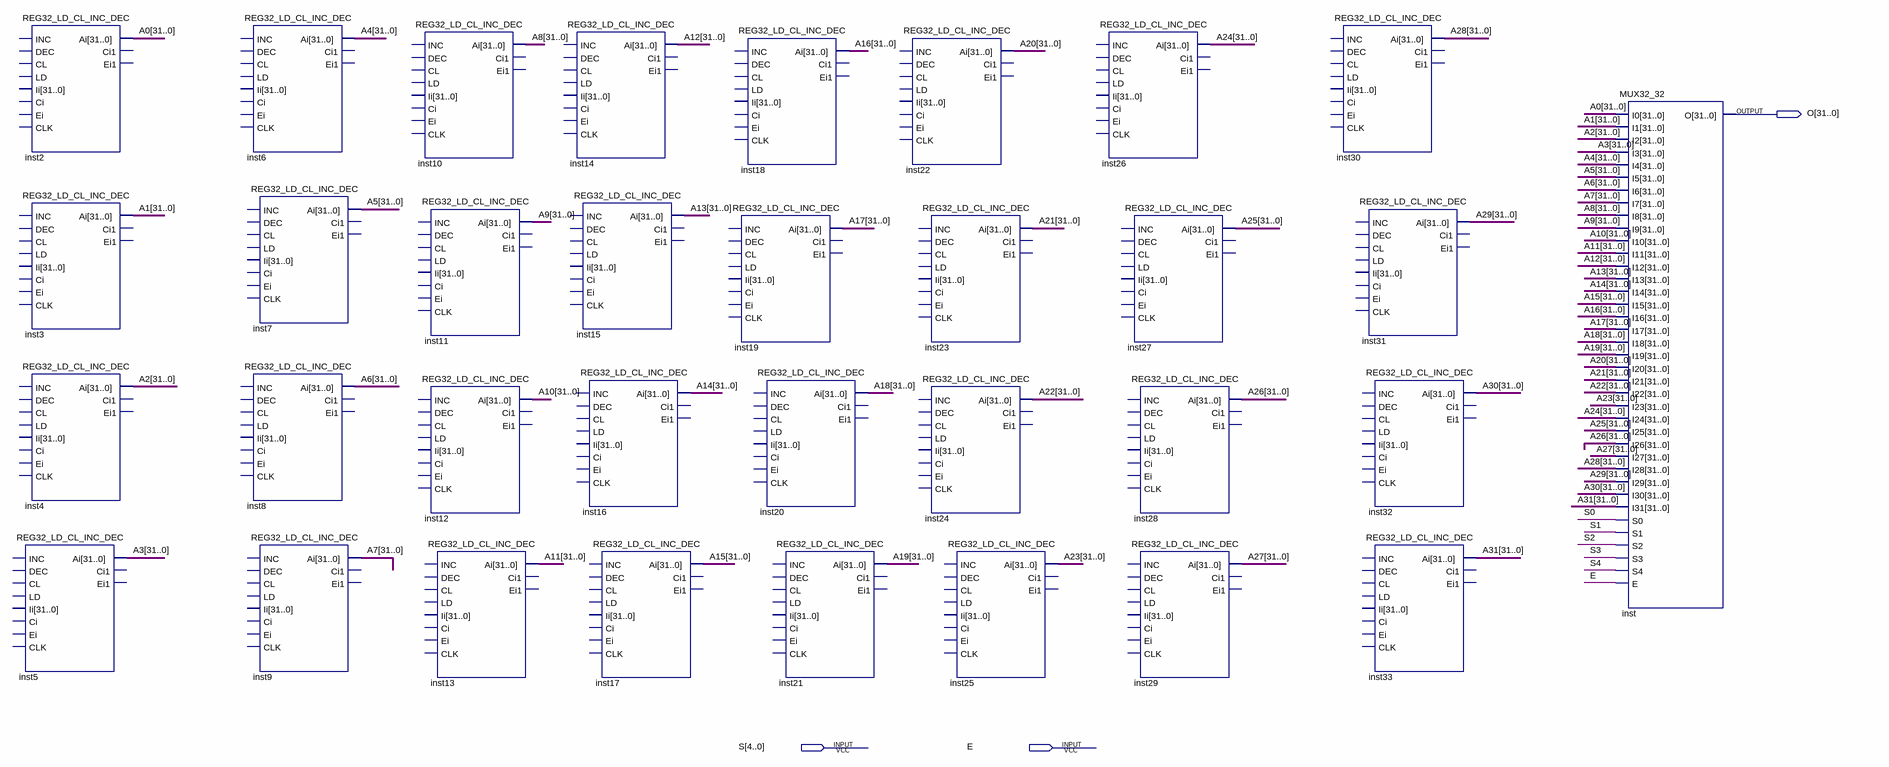
[diagram p0: schematic sheet]
// Quartus schematic 32xREG32_FILE.bdf as structural Verilog: 33 symbols, 3 pins
module \32xREG32_FILE  (
  input  [4:0] S,
  input  E,
  output [31:0] O
);

  wire [31:0] A0, A1, A2, A3, A4, A5, A6, A7, A8, A9, A10, A11, A12, A13, A14, A15, A16, A17, A18, A19, A20,
       A21, A22, A23, A24, A25, A26, A27, A28, A29, A30, A31;

  REG32_LD_CL_INC_DEC inst2 (.Ai(A0));  // open: INC, DEC, CL, LD, Ii, Ci, Ei, CLK, Ci1, Ei1
  REG32_LD_CL_INC_DEC inst3 (.Ai(A1));  // open: INC, DEC, CL, LD, Ii, Ci, Ei, CLK, Ci1, Ei1
  REG32_LD_CL_INC_DEC inst4 (.Ai(A2));  // open: INC, DEC, CL, LD, Ii, Ci, Ei, CLK, Ci1, Ei1
  REG32_LD_CL_INC_DEC inst5 (.Ai(A3));  // open: INC, DEC, CL, LD, Ii, Ci, Ei, CLK, Ci1, Ei1
  REG32_LD_CL_INC_DEC inst6 (.Ai(A4));  // open: INC, DEC, CL, LD, Ii, Ci, Ei, CLK, Ci1, Ei1
  REG32_LD_CL_INC_DEC inst7 (.Ai(A5));  // open: INC, DEC, CL, LD, Ii, Ci, Ei, CLK, Ci1, Ei1
  REG32_LD_CL_INC_DEC inst8 (.Ai(A6));  // open: INC, DEC, CL, LD, Ii, Ci, Ei, CLK, Ci1, Ei1
  REG32_LD_CL_INC_DEC inst9 (.Ai(A7));  // open: INC, DEC, CL, LD, Ii, Ci, Ei, CLK, Ci1, Ei1
  REG32_LD_CL_INC_DEC inst10 (.Ai(A8));  // open: INC, DEC, CL, LD, Ii, Ci, Ei, CLK, Ci1, Ei1
  REG32_LD_CL_INC_DEC inst11 (.Ai(A9));  // open: INC, DEC, CL, LD, Ii, Ci, Ei, CLK, Ci1, Ei1
  REG32_LD_CL_INC_DEC inst12 (.Ai(A10));  // open: INC, DEC, CL, LD, Ii, Ci, Ei, CLK, Ci1, Ei1
  REG32_LD_CL_INC_DEC inst13 (.Ai(A11));  // open: INC, DEC, CL, LD, Ii, Ci, Ei, CLK, Ci1, Ei1
  REG32_LD_CL_INC_DEC inst14 (.Ai(A12));  // open: INC, DEC, CL, LD, Ii, Ci, Ei, CLK, Ci1, Ei1
  REG32_LD_CL_INC_DEC inst15 (.Ai(A13));  // open: INC, DEC, CL, LD, Ii, Ci, Ei, CLK, Ci1, Ei1
  REG32_LD_CL_INC_DEC inst16 (.Ai(A14));  // open: INC, DEC, CL, LD, Ii, Ci, Ei, CLK, Ci1, Ei1
  REG32_LD_CL_INC_DEC inst17 (.Ai(A15));  // open: INC, DEC, CL, LD, Ii, Ci, Ei, CLK, Ci1, Ei1
  REG32_LD_CL_INC_DEC inst18 (.Ai(A16));  // open: INC, DEC, CL, LD, Ii, Ci, Ei, CLK, Ci1, Ei1
  REG32_LD_CL_INC_DEC inst19 (.Ai(A17));  // open: INC, DEC, CL, LD, Ii, Ci, Ei, CLK, Ci1, Ei1
  REG32_LD_CL_INC_DEC inst20 (.Ai(A18));  // open: INC, DEC, CL, LD, Ii, Ci, Ei, CLK, Ci1, Ei1
  REG32_LD_CL_INC_DEC inst21 (.Ai(A19));  // open: INC, DEC, CL, LD, Ii, Ci, Ei, CLK, Ci1, Ei1
  REG32_LD_CL_INC_DEC inst22 (.Ai(A20));  // open: INC, DEC, CL, LD, Ii, Ci, Ei, CLK, Ci1, Ei1
  REG32_LD_CL_INC_DEC inst23 (.Ai(A21));  // open: INC, DEC, CL, LD, Ii, Ci, Ei, CLK, Ci1, Ei1
  REG32_LD_CL_INC_DEC inst24 (.Ai(A22));  // open: INC, DEC, CL, LD, Ii, Ci, Ei, CLK, Ci1, Ei1
  REG32_LD_CL_INC_DEC inst25 (.Ai(A23));  // open: INC, DEC, CL, LD, Ii, Ci, Ei, CLK, Ci1, Ei1
  REG32_LD_CL_INC_DEC inst26 (.Ai(A24));  // open: INC, DEC, CL, LD, Ii, Ci, Ei, CLK, Ci1, Ei1
  REG32_LD_CL_INC_DEC inst27 (.Ai(A25));  // open: INC, DEC, CL, LD, Ii, Ci, Ei, CLK, Ci1, Ei1
  REG32_LD_CL_INC_DEC inst28 (.Ai(A26));  // open: INC, DEC, CL, LD, Ii, Ci, Ei, CLK, Ci1, Ei1
  REG32_LD_CL_INC_DEC inst29 (.Ai(A27));  // open: INC, DEC, CL, LD, Ii, Ci, Ei, CLK, Ci1, Ei1
  REG32_LD_CL_INC_DEC inst30 (.Ai(A28));  // open: INC, DEC, CL, LD, Ii, Ci, Ei, CLK, Ci1, Ei1
  REG32_LD_CL_INC_DEC inst31 (.Ai(A29));  // open: INC, DEC, CL, LD, Ii, Ci, Ei, CLK, Ci1, Ei1
  REG32_LD_CL_INC_DEC inst32 (.Ai(A30));  // open: INC, DEC, CL, LD, Ii, Ci, Ei, CLK, Ci1, Ei1
  REG32_LD_CL_INC_DEC inst33 (.Ai(A31));  // open: INC, DEC, CL, LD, Ii, Ci, Ei, CLK, Ci1, Ei1
  MUX32_32 inst (
    .I0(A0), .I1(A1), .I2(A2), .I3(A3), .I4(A4), .I5(A5), .I6(A6), .I7(A7), .I8(A8), .I9(A9), .I10(A10),
    .I11(A11), .I12(A12), .I13(A13), .I14(A14), .I15(A15), .I16(A16), .I17(A17), .I18(A18), .I19(A19),
    .I20(A20), .I21(A21), .I22(A22), .I23(A23), .I24(A24), .I25(A25), .I26(A26), .I27(A27), .I28(A28),
    .I29(A29), .I30(A30), .I31(A31), .S0(S[0]), .S1(S[1]), .S2(S[2]), .S3(S[3]), .S4(S[4]), .E(E), .O(O));
endmodule
